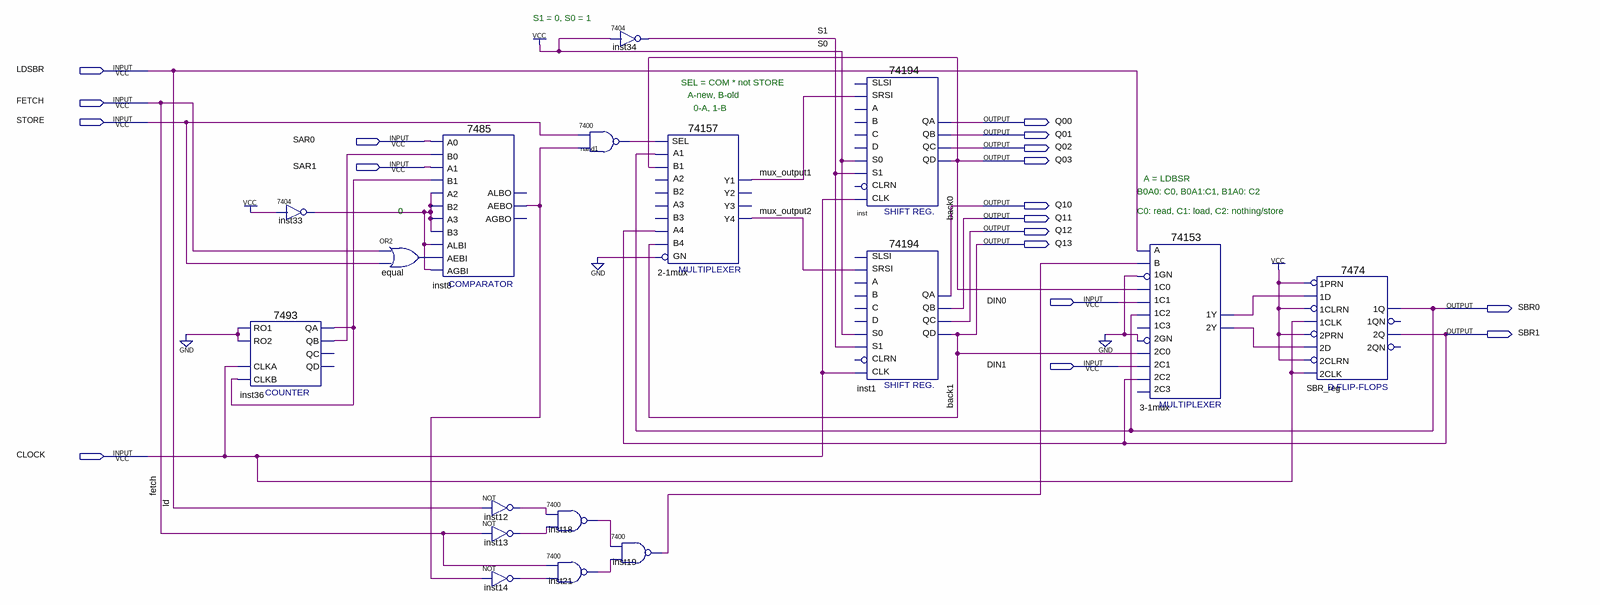
[diagram p0: schematic sheet]
// Quartus schematic Lab2.bdf as structural Verilog: 17 symbols, 18 pins
module Lab2 (
  input  LDSBR,
  input  FETCH,
  input  STORE,
  input  SAR0,
  input  SAR1,
  input  DIN0,
  input  DIN1,
  input  CLOCK,
  output Q00,
  output Q01,
  output Q02,
  output Q03,
  output Q10,
  output Q11,
  output Q12,
  output Q13,
  output SBR0,
  output SBR1
);

  wire equal_out, inst8_aebo, inst12_out, inst13_out, inst14_out, inst18_1, inst19_1, inst21_1, inst33_1,
       inst36_qa, inst36_qb, mux_output1, mux_output2, n3_1mux_1y, n3_1mux_2y, nand1_1, S1;

  \7493  inst36 (
    .RO1(1'b0), .RO2(1'b0), .CLKA(CLOCK), .CLKB(inst36_qa), .QB(inst36_qb), .QA(inst36_qa));  // open: QC, QD
  \7404  inst33 (.\2 (1'b1), .\1 (inst33_1));
  or equal (equal_out, FETCH, STORE);
  \7485  inst8 (
    .A3(inst33_1), .B2(inst33_1), .A2(inst33_1), .AEBI(equal_out), .AGBI(inst33_1), .ALBI(inst33_1),
    .A0(SAR0), .B0(inst36_qb), .B3(inst33_1), .A1(SAR1), .B1(inst36_qa), .AEBO(inst8_aebo));  // open: ALBO, AGBO
  not inst12 (inst12_out, LDSBR);
  not inst13 (inst13_out, FETCH);
  not inst14 (inst14_out, inst8_aebo);
  \7400  inst18 (.\3 (inst13_out), .\2 (inst12_out), .\1 (inst18_1));
  \7400  inst21 (.\3 (inst14_out), .\2 (FETCH), .\1 (inst21_1));
  \7400  nand1 (.\3 (inst8_aebo), .\2 (STORE), .\1 (nand1_1));
  \7404  inst34 (.\2 (1'b1), .\1 (S1));
  \74157  \u_2-1mux  (
    .A1(SBR0), .B1(Q03), .SEL(nand1_1), .B4(Q13), .GN(1'b0), .A4(SBR1), .Y1(mux_output1), .Y4(mux_output2));  // open: B2, A3, B3, A2, Y2, Y3
  \7400  inst19 (.\3 (inst21_1), .\2 (inst18_1), .\1 (inst19_1));
  \74194  inst (
    .SRSI(mux_output1), .CLK(CLOCK), .S1(S1), .S0(1'b1), .QA(Q00), .QB(Q01), .QC(Q02), .QD(Q03));  // open: SLSI, B, C, CLRN, D, A
  \74194  inst1 (
    .SRSI(mux_output2), .CLK(CLOCK), .S1(S1), .S0(1'b1), .QA(Q10), .QB(Q11), .QC(Q12), .QD(Q13));  // open: SLSI, B, C, CLRN, D, A
  \74153  \u_3-1mux  (
    .\1C1 (DIN0), .\1GN (1'b0), .\1C0 (Q03), .\2C0 (Q13), .\2GN (1'b0), .\2C2 (SBR1), .\1C2 (SBR0),
    .B(inst19_1), .A(LDSBR), .\2C1 (DIN1), .\1Y (n3_1mux_1y), .\2Y (n3_1mux_2y));  // open: 1C3, 2C3
  \7474  SBR_reg (
    .\2D (n3_1mux_2y), .\2PRN (1'b1), .\1CLK (CLOCK), .\1D (n3_1mux_1y), .\1PRN (1'b1), .\2CLK (CLOCK),
    .\2CLRN (1'b1), .\1CLRN (1'b1), .\2Q (SBR1), .\1Q (SBR0));  // open: 1QN, 2QN

  // Other names for the same wires on the sheet: back0 = Q03; back1 = Q13; ld = LDSBR

  // Notes on the sheet:
  //   S1 = 0, S0 = 1
  //   SEL = COM * not STORE
  //   A-new, B-old
  //   0-A, 1-B
  //   A = LDBSR
  //   B0A0: C0, B0A1:C1, B1A0: C2
  //   0
  //   C0: read, C1: load, C2: nothing/store
endmodule
